# Altium schematic sheet arm_sheet.SchDoc
size A4
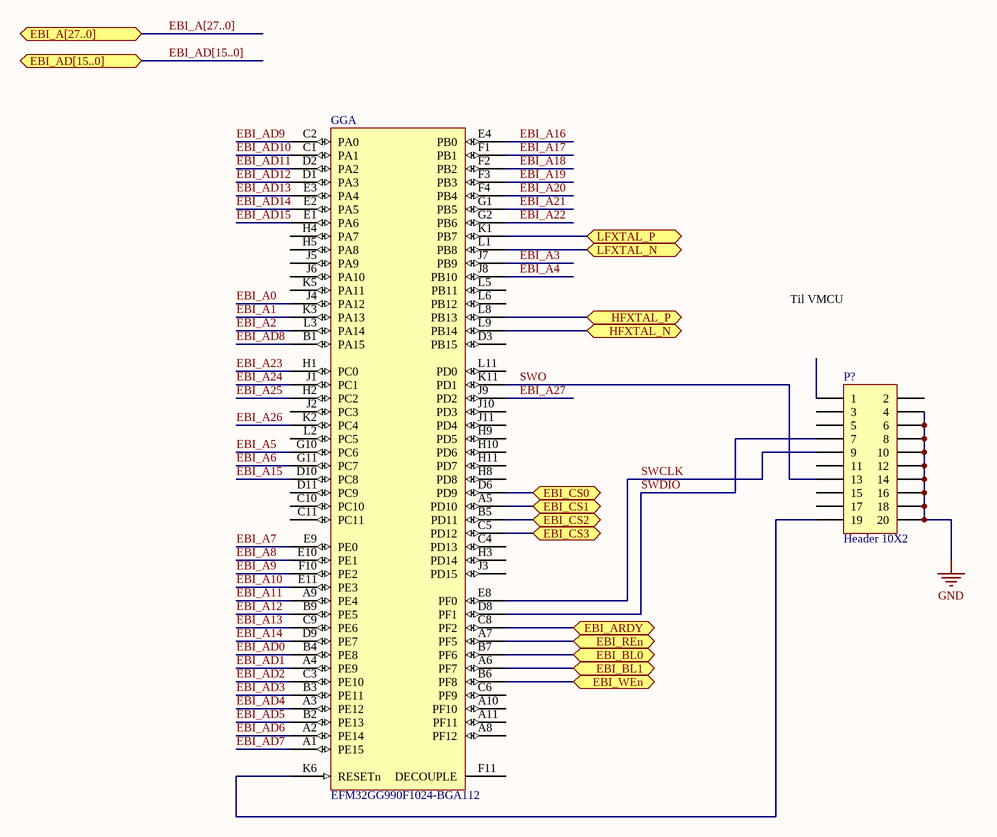
[diagram p0: arm_sheet.SchDoc]

## Parts
GG  EFM32GG990F1024-BGA112  [ENMR-BGA112]  (part A of 2)
P?  Header 10X2  [HDR2X10]

## Ports
EBI_A[27..0] (bidir), EBI_AD[15..0] (bidir), EBI_ARDY, EBI_BL0, EBI_BL1, EBI_CS0 (bidir), EBI_CS1 (bidir), EBI_CS2 (bidir), EBI_CS3 (bidir), EBI_REn, EBI_WEn, HFXTAL_N (bidir), HFXTAL_P (bidir), LFXTAL_N, LFXTAL_P

## Nets
GND: P?.4 P?.6 P?.8 P?.10 P?.12 P?.14 P?.16 P?.18 P?.20
EBI_A0: GG.J4(PA12)
EBI_A1: GG.K3(PA13)
EBI_A2: GG.L3(PA14)
EBI_A3: GG.J7(PB9)
EBI_A4: GG.J8(PB10)
EBI_A5: GG.G10(PC6)
EBI_A6: GG.G11(PC7)
EBI_A7: GG.E9(PE0)
EBI_A8: GG.E10(PE1)
EBI_A9: GG.F10(PE2)
EBI_A10: GG.E11(PE3)
EBI_A11: GG.A9(PE4)
EBI_A12: GG.B9(PE5)
EBI_A13: GG.C9(PE6)
EBI_A14: GG.D9(PE7)
EBI_A15: GG.D10(PC8)
EBI_A16: GG.E4(PB0)
EBI_A17: GG.F1(PB1)
EBI_A18: GG.F2(PB2)
EBI_A19: GG.F3(PB3)
EBI_A20: GG.F4(PB4)
EBI_A21: GG.G1(PB5)
EBI_A22: GG.G2(PB6)
EBI_A23: GG.H1(PC0)
EBI_A24: GG.J1(PC1)
EBI_A25: GG.H2(PC2)
EBI_A26: GG.K2(PC4)
EBI_A27: GG.J9(PD2)
EBI_AD0: GG.B4(PE8)
EBI_AD1: GG.A4(PE9)
EBI_AD2: GG.C3(PE10)
EBI_AD3: GG.B3(PE11)
EBI_AD4: GG.A3(PE12)
EBI_AD5: GG.B2(PE13)
EBI_AD6: GG.A2(PE14)
EBI_AD7: GG.A1(PE15)
EBI_AD8: GG.B1(PA15)
EBI_AD9: GG.C2(PA0)
EBI_AD10: GG.C1(PA1)
EBI_AD11: GG.D2(PA2)
EBI_AD12: GG.D1(PA3)
EBI_AD13: GG.E3(PA4)
EBI_AD14: GG.E2(PA5)
EBI_AD15: GG.E1(PA6)
EBI_ARDY: GG.C8(PF2) ; port EBI_ARDY
EBI_BL0: GG.B7(PF6) ; port EBI_BL0
EBI_BL1: GG.A6(PF7) ; port EBI_BL1
EBI_CS0: GG.D6(PD9) ; port EBI_CS0
EBI_CS1: GG.A5(PD10) ; port EBI_CS1
EBI_CS2: GG.B5(PD11) ; port EBI_CS2
EBI_CS3: GG.C5(PD12) ; port EBI_CS3
EBI_REn: GG.A7(PF5) ; port EBI_REn
EBI_WEn: GG.B6(PF8) ; port EBI_WEn
HFXTAL_N: GG.L9(PB14) ; port HFXTAL_N
HFXTAL_P: GG.L8(PB13) ; port HFXTAL_P
LFXTAL_N: GG.L1(PB8) ; port LFXTAL_N
LFXTAL_P: GG.K1(PB7) ; port LFXTAL_P
SWCLK: GG.E8(PF0) P?.9
SWDIO: GG.D8(PF1) P?.7
SWO: GG.K11(PD1) P?.13
NetGG_K6: GG.K6(RESETn) P?.19

Not connected (* = marked no-connect by the designer): GG A8(PF12) A10(PF10) A11(PF11) C4(PD13) C6(PF9) C10(PC10) C11(PC11) D3(PB15) D11(PC9) F11(DECOUPLE) H3(PD14) H4(PA7) H5(PA8) H8(PD8) H9(PD5) H10(PD6) H11(PD7) J2(PC3) J3(PD15) J5(PA9) J6(PA10) J10(PD3) J11(PD4) K5(PA11) L2(PC5) L5(PB11) L6(PB12) L11(PD0); P? 1 2 3 5 11 15 17

## Buses and harness runs
bus EBI_A[27..0] = port EBI_A[27..0]
bus EBI_AD[15..0] = port EBI_AD[15..0]

## Notes on the sheet
- (near P?) Til VMCU

## Library data of the parts
GG = EFM32GG990F1024-BGA112: EFM32 Giant Gecko, M3 ARM Cortex CPU, 1024 KB Flash, 128 KB RAM, 1.85 - 3.8 V Supply, 48 MHz Max Speed, -40 to 85 degC, 112-Pin BGA, RoHS Compliant; Flash (KB): 1024; GPIO: 87; LCD: 8x34; LESENSE: Y; Max Speed (MHz): 48; OPAMPS: 3; RAM (KB): 128; DatasheetVersion: Rev 1.00; PackageVersion: Rev. 97SPP01315A_X03_06Jun11; PackageReference: BGA112; PackageDescription: 112-Pin Ball Grid Array, Body 10 x 10 mm, Pitch 0.8 mm; Supplier 1: Digi-Key; Supplier Part Number 1: 914-1051-2-ND; Supplier 2: Digi-Key; Supplier Part Number 2: 914-1051-1-ND; Supplier 3: Digi-Key; Supplier Part Number 3: 914-1051-6-ND; Supplier 4: Mouser; Supplier Part Number 4: 904-EFM32GG990F1024; ARM Cortex CPU: M3; Subcategory: EFM32 Giant Gecko; Supply Voltage (V): 1.85 - 3.8; USB: Y; Mounting Technology: Surface Mount; Generic Part Number: EFM32GG990; PartNumber: EFM32GG990F1024-BGA112; ComponentLink1Description: Manufacturer URL; ComponentLink1URL: http://www.energymicro.com/; ComponentLink2Description: Datasheet; ComponentLink2URL: http://cdn.energymicro.com/dl/devices/pdf/d0046_efm32gg990_datasheet.pdf; ComponentLink3Description: Package Specification; ComponentLink3URL: http://cdn.energymicro.com/dl/devices/pdf/d0007_efm32g290_datasheet.pdf
P? = Header 10X2: Header, 10-Pin, Dual row; LatestRevisionDate: 17-Jul-2002; LatestRevisionNote: Re-released for DXP Platform.; Publisher: Altium Limited